# Altium schematic sheet APM32F030K8T6核心板原理图.SchDoc
size A4
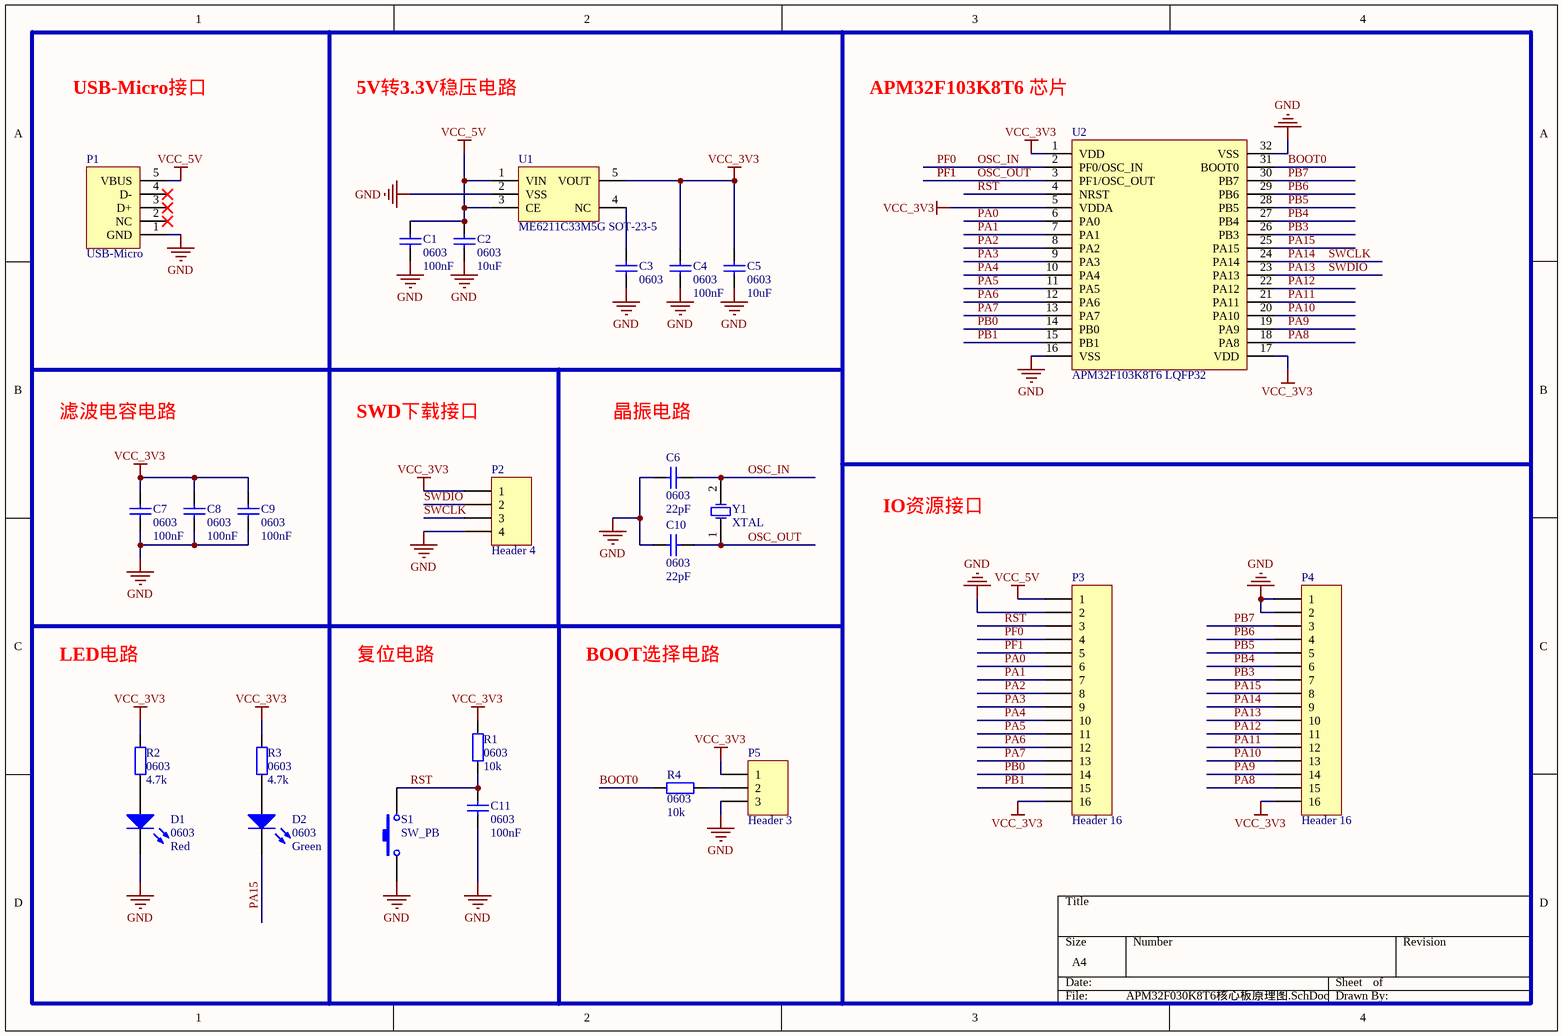
[diagram p0: APM32F030K8T6核心板原理图.SchDoc]

## Parts
C1  value 100nF  footprint: 0603  [R0603-R/C-Y]  (hidden comment: Cap 0603)
C2  value 10uF  footprint: 0603  [R0603-R/C-Y]  (hidden comment: Cap 0603)
C3  footprint: 0603  [R0603-R/C-Y]  (hidden comment: Cap 0603)
C4  value 100nF  footprint: 0603  [R0603-R/C-Y]  (hidden comment: Cap 0603)
C5  value 10uF  footprint: 0603  [R0603-R/C-Y]  (hidden comment: Cap 0603)
C6  value 22pF  footprint: 0603  [R0603-R/C-Y]  (hidden comment: Cap 0603)
C7  value 100nF  footprint: 0603  [R0603-R/C-Y]  (hidden comment: Cap 0603)
C8  value 100nF  footprint: 0603  [R0603-R/C-Y]  (hidden comment: Cap 0603)
C9  value 100nF  footprint: 0603  [R0603-R/C-Y]  (hidden comment: Cap 0603)
C10  value 22pF  footprint: 0603  [R0603-R/C-Y]  (hidden comment: Cap 0603)
C11  value 100nF  footprint: 0603  [R0603-R/C-Y]  (hidden comment: Cap 0603)
D1  value Red  Footprint: 0603  [0603-LED-G]  (hidden comment: LED 0603)
D2  value Green  Footprint: 0603  [0603-LED-G]  (hidden comment: LED 0603)
P1  USB-Micro  [USB Micro]
P2  Header 4  [HDR1X4]
P3  Header 16  [HDR1X16]
P4  Header 16  [HDR1X16]
P5  Header 3  [HDR1X3]
R1  value 10k  Footprint: 0603  [R0603-R/C-BY]  (hidden comment: Res 0603)
R2  value 4.7k  Footprint: 0603  [R0603-R/C-BY]  (hidden comment: Res 0603)
R3  value 4.7k  Footprint: 0603  [R0603-R/C-BY]  (hidden comment: Res 0603)
R4  value 10k  Footprint: 0603  [R0603-R/C-BY]  (hidden comment: Res 0603)
S1  SW_PB  [SW-2Pin]
U1  ME6211C33M5G SOT-23-5  [SOT-23-5]
U2  APM32F103K8T6 LQFP32  [QFP32_M]
Y1  XTAL  [XTAL_5032]

## Nets
GND: C1.1 C2.1 C3.1 C4.1 C5.1 C6.2 C7.1 C8.1 C9.1 C10.2 C11.1 D1.2(K) P1.1(GND) P2.4 P3.2 P4.1 P4.2 P5.3 S1.1 U1.2(VSS) U2.16(VSS) U2.32(VSS)
VCC_3V3: C4.2 C5.2 C7.2 C8.2 C9.2 P2.1 P3.16 P4.16 P5.1 R1.2 R2.1 R3.1 U1.5(VOUT) U2.1(VDD) U2.5(VDDA) U2.17(VDD)
VCC_5V: C1.2 C2.2 P1.5(VBUS) P3.1 U1.1(VIN) U1.3(CE)
BOOT0: R4.1 U2.31(BOOT0)
OSC_IN: C6.1 P3.4 U2.2(PF0/OSC_IN) Y1.2(OSC2)  [also labelled PF0]
OSC_OUT: C10.1 P3.5 U2.3(PF1/OSC_OUT) Y1.1(OSC1)  [also labelled PF1]
PA0: P3.6 U2.6(PA0)
PA1: P3.7 U2.7(PA1)
PA2: P3.8 U2.8(PA2)
PA3: P3.9 U2.9(PA3)
PA4: P3.10 U2.10(PA4)
PA5: P3.11 U2.11(PA5)
PA6: P3.12 U2.12(PA6)
PA7: P3.13 U2.13(PA7)
PA8: P4.15 U2.18(PA8)
PA9: P4.14 U2.19(PA9)
PA10: P4.13 U2.20(PA10)
PA11: P4.12 U2.21(PA11)
PA12: P4.11 U2.22(PA12)
PA13: P2.2 P4.10 U2.23(PA13)  [also labelled SWDIO]
PA14: P2.3 P4.9 U2.24(PA14)  [also labelled SWCLK]
PA15: D2.2(K) P4.8 U2.25(PA15)
PB0: P3.14 U2.14(PB0)
PB1: P3.15 U2.15(PB1)
PB3: P4.7 U2.26(PB3)
PB4: P4.6 U2.27(PB4)
PB5: P4.5 U2.28(PB5)
PB6: P4.4 U2.29(PB6)
PB7: P4.3 U2.30(PB7)
RST: C11.2 P3.3 R1.1 S1.2 U2.4(NRST)
NetC3_2: C3.2 U1.4(NC)
NetD1_1: D1.1(A) R2.2
NetD2_1: D2.1(A) R3.2
NetP5_2: P5.2 R4.2

Not connected (* = marked no-connect by the designer): P1 2(NC)* 3(D+)* 4(D-)*

## Notes on the sheet
- USB-Micro接口
- 5V转3.3V稳压电路
- APM32F103K8T6 芯片
- 滤波电容电路
- SWD下载接口
- 晶振电路
- IO资源接口
- LED电路
- 复位电路
- BOOT选择电路

## Library data of the parts
C1 C2 C4-C11 = Cap 0603: Capacitor 0603
C3 = Cap 0603: Capacitor 0603; value: 100nF
P2 = Header 4: Header, 4-Pin; LatestRevisionDate: 17-Jul-2002; LatestRevisionNote: Re-released for DXP Platform.; Publisher: Altium Limited
P3 P4 = Header 16: Header, 16-Pin; LatestRevisionDate: 17-Jul-2002; LatestRevisionNote: Re-released for DXP Platform.; Publisher: Altium Limited
P5 = Header 3: Header, 3-Pin; LatestRevisionDate: 17-Jul-2002; LatestRevisionNote: Re-released for DXP Platform.; Publisher: Altium Limited
R1-R4 = Res 0603: Resistor 0603
U1 = ME6211C33M5G
U2 = STM32F030K6T6 LQFP32
Y1 = XTAL 8MHZ